# Altium schematic sheet BQ76930.SchDoc
size A3
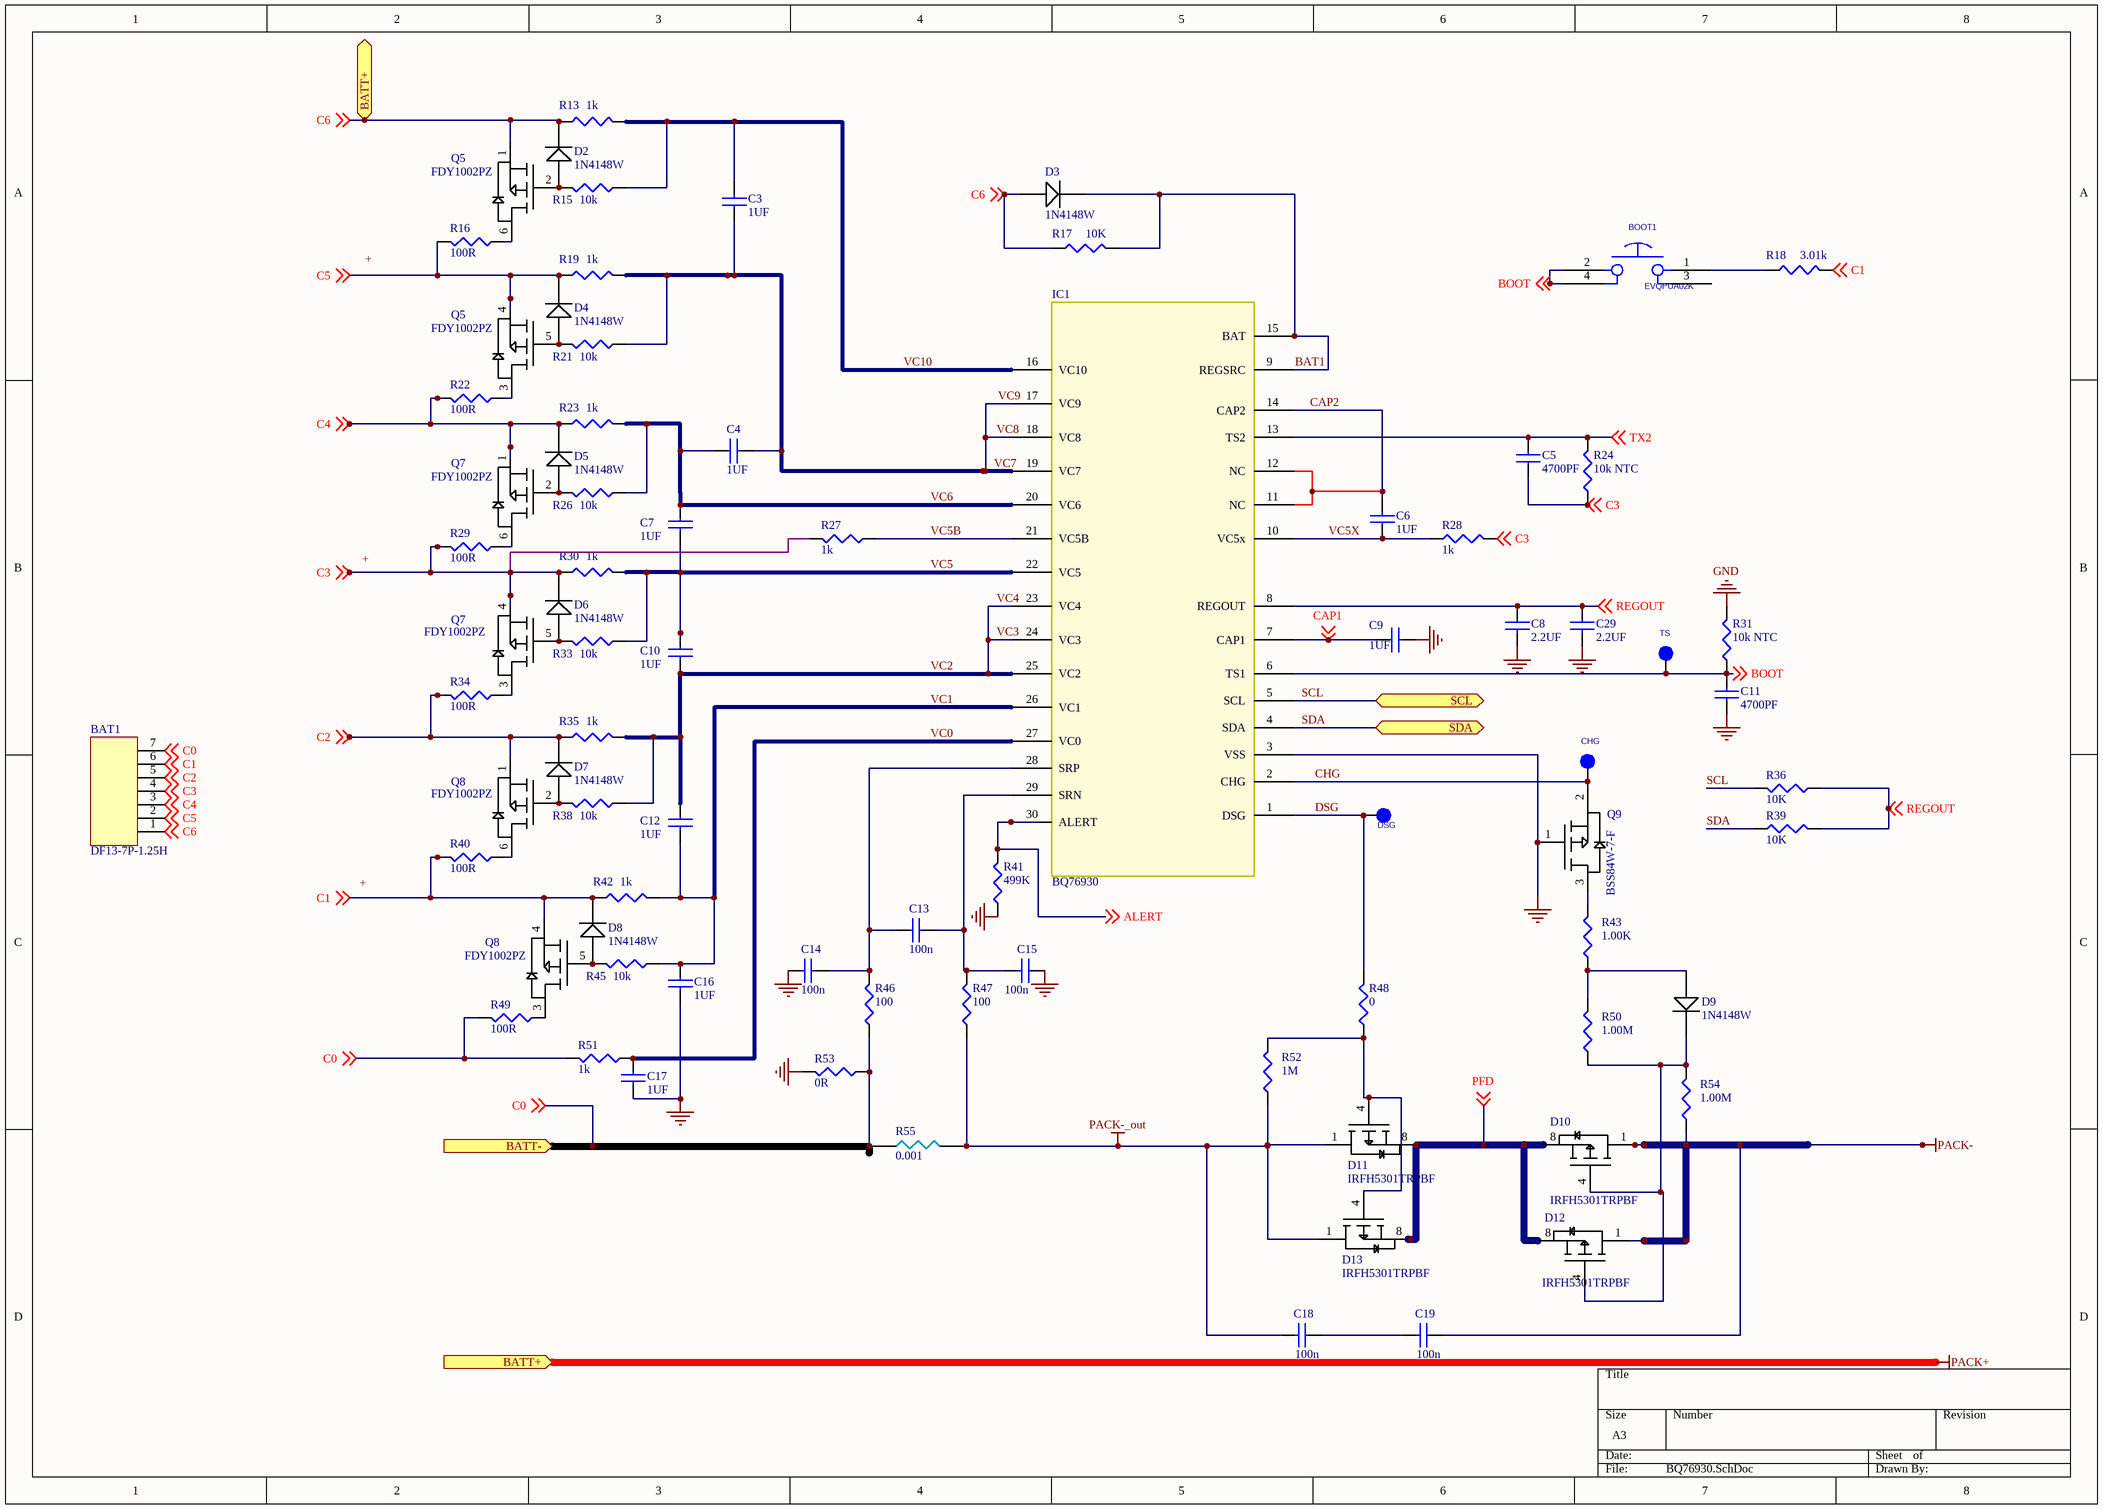
[diagram p0: BQ76930.SchDoc]

## Parts
(Parts that share a designator on the sheet are numbered #1, #2 ... from top to bottom, then left to right.)
BAT1  DF13-7P-1.25H  [DF13-7P-1.25H]
BOOT1  EVQPUA02K  [SKRPAB]
C3  1UF  [0603c]
C4  1UF  [0603c]
C5  4700PF  [0603C]
C6  1UF  [0603c]
C7  1UF  [0603c]
C8  2.2UF  [0603c]
C9  1UF  [0603c]
C10  1UF  [0603c]
C11  4700PF  [0603C]
C12  1UF  [0603c]
C13  100n  [0402CAP]
C14  100n  [0402CAP]
C15  100n  [0402CAP]
C16  1UF  [0603c]
C17  1UF  [0603c]
C18  100n  [0402CAP]
C19  100n  [0402CAP]
C29  2.2UF  [0603c]
CHG  tpad_020  [tpad_020]  (value not drawn)
D2  1N4148W  [SOD323]
D3  1N4148W  [SOD-123]
D4  1N4148W  [SOD323]
D5  1N4148W  [SOD323]
D6  1N4148W  [SOD323]
D7  1N4148W  [SOD323]
D8  1N4148W  [SOD323]
D9  1N4148W  [SOD-123]
D10  IRFH5301TRPBF  [SON5x6]
D11  IRFH5301TRPBF  [SON5x6]
D12  IRFH5301TRPBF  [SON5x6]
D13  IRFH5301TRPBF  [SON5x6]
DSG  tpad_020  [tpad_020]  (value not drawn)
IC1  BQ76930  [TSSOP30]
Q5#1  FDY1002PZ
Q5#2  FDY1002PZ  [DFN2*2-6L]
Q7#1  FDY1002PZ
Q7#2  FDY1002PZ  [DFN2*2-6L]
Q8#1  FDY1002PZ
Q8#2  FDY1002PZ  [DFN2*2-6L]
Q9  BSS84W-7-F  [SOT-323]
R13  1k  [0603r]
R15  10k  [0603r]
R16  100R  [0603r]
R17  10K  [0603R]
R18  3.01k  [0603R]
R19  1k  [0603r]
R21  10k  [0603r]
R22  100R  [0603r]
R23  1k  [0603r]
R24  10k NTC  [0603R]
R26  10k  [0603r]
R27  1k  [0603r]
R28  1k  [0603R]
R29  100R  [0603r]
R30  1k  [0603r]
R31  10k NTC  [0603R]
R33  10k  [0603r]
R34  100R  [0603r]
R35  1k  [0603r]
R36  10K  [0603R]
R38  10k  [0603r]
R39  10K  [0603R]
R40  100R  [0603r]
R41  499K  [0603R]
R42  1k  [0603r]
R43  1.00K  [0603R]
R45  10k  [0603r]
R46  100  [0603R]
R47  100  [0603R]
R48  0  [0603R]
R49  100R  [0603r]
R50  1.00M  [0603R]
R51  1k  [0603r]
R52  1M  [0603R]
R53  0R  [0805L]
R54  1.00M  [0603R]
R55  0.001  [Dale_WSR-3]
TS  tpad_020  [tpad_020]  (value not drawn)

## Ports
BATT+ (in), BATT- (in), SCL, SDA

## Nets
GND: C8.2 C9.2 C11.1 C14.1 C15.1 C16.2 C17.2 C29.2 IC1.3(VSS) Q9.1(G) R31.2 R41.1 R53.2
PACK+: BAT1.1 D2.C(K) D3.A Q5#1.1(S) R13.1 R17.1 ; off-sheet C6, port BATT+  [also labelled C6]
PACK-: C19.1 D10.1(S) D12.1(S) R54.1
PACK-_out: C18.2 D11.1(S) D13.1(S) R47.1 R52.1 R55.2
ALERT: IC1.30(ALERT) R41.2 ; off-sheet ALERT
BAT1: D3.K IC1.9(REGSRC) IC1.15(BAT) R17.2
BOOT: BOOT1.2 BOOT1.4 C11.2 IC1.6(TS1) R31.1 TS.1(Pin1) ; off-sheet BOOT
C0: BAT1.7 R46.1 R49.2 R51.2 R53.1 R55.1 ; off-sheet C0, port BATT-
C1: BAT1.6 D8.C Q8#2.4(S) R18.2 R40.2 R42.1 ; off-sheet C1
C2: BAT1.5 D7.C(K) Q8#1.1(S) R34.2 R35.1 ; off-sheet C2
C3: BAT1.4 C5.1 D6.C(K) Q7#2.4(S) R24.1 R27.2 R28.2 R29.2 R30.1 ; off-sheet C3
C4: BAT1.3 D5.C(K) Q7#1.1(S) R22.2 R23.1 ; off-sheet C4
C5: BAT1.2 D4.C(K) Q5#2.4(S) R16.2 R19.1 ; off-sheet C5
CAP1: C9.1 IC1.7(CAP1) ; off-sheet CAP1
CAP2: C6.2 IC1.11(NC) IC1.12(NC) IC1.14(CAP2)
CHG: CHG.1(Pin1) IC1.2(CHG) Q9.2(S)
DSG: DSG.1(Pin1) IC1.1(DSG) R48.2
PFD: D10.8(D) D11.8(D) D12.8(D) D13.8(D) ; off-sheet PFD
REGOUT: C8.1 C29.1 IC1.8(REGOUT) R36.1 R39.2 ; off-sheet REGOUT
SCL: IC1.5(SCL) R36.2 ; port SCL
SDA: IC1.4(SDA) R39.1 ; port SDA
TX2: C5.2 IC1.13(TS2) R24.2 ; off-sheet TX2
VC0: C17.1 IC1.27(VC0) R51.1
VC1: C12.2 C16.1 IC1.26(VC1) R42.2 R45.1
VC2: C10.2 C12.1 IC1.23(VC4) IC1.24(VC3) IC1.25(VC2) R35.2 R38.1  [also labelled VC3, VC4]
VC5: C7.2 C10.1 IC1.22(VC5) R30.2 R33.1
VC5B: IC1.21(VC5B) R27.1
VC5X: C6.1 IC1.10(VC5x) R28.1
VC6: C4.1 C7.1 IC1.20(VC6) R23.2 R26.1
VC7: C3.1 C4.2 IC1.17(VC9) IC1.18(VC8) IC1.19(VC7) R19.2 R21.1  [also labelled VC8, VC9]
VC10: C3.2 IC1.16(VC10) R13.2 R15.1
NetBOOT1_1: BOOT1.1 R18.1
NetC13_1: C13.1 C14.2 IC1.28(SRP) R46.2
NetC13_2: C13.2 C15.2 IC1.29(SRN) R47.2
NetC18_1: C18.1 C19.2
NetD2_A: D2.A Q5#1.2(G) R15.2
NetD4_A: D4.A Q5#2.5(G) R21.2
NetD5_A: D5.A Q7#1.2(G) R26.2
NetD6_A: D6.A Q7#2.5(G) R33.2
NetD7_A: D7.A Q8#1.2(G) R38.2
NetD8_A: D8.A Q8#2.5(G) R45.2
NetD9_A: D9.A R43.1 R50.2
NetD9_K: D9.K D10.4(G) D12.4(G) R50.1 R54.2
NetD11_4: D11.4(G) D13.4(G) R48.1 R52.2
NetQ5#1_6: Q5#1.6(D) R16.1
NetQ5#2_3: Q5#2.3(D) R22.1
NetQ7#1_6: Q7#1.6(D) R29.1
NetQ7#2_3: Q7#2.3(D) R34.1
NetQ8#1_6: Q8#1.6(D) R40.1
NetQ8#2_3: Q8#2.3(D) R49.1
NetQ9_3: Q9.3(D) R43.2

Not connected (* = marked no-connect by the designer): BOOT1 3

## Notes on the sheet
- Labels drawn without touching a wire or pin: +

## Library data of the parts
BOOT1 = EDGE_MOUNT_PB_SW_2: SW SPST NO PB 2.2N SIDE 12V 50MA SMT; CLASS: IC; CAD_APPROVED: Yes; MFG_NAME01: PANASONIC; AGILE_PN: 510-76838; HEIGHT: 1.95MM; ROHS: Yes; MFG_PN01: EVQPUA02K
C3-C19 C29 = C1005X5R1H104K: CAP CER .10UF 50V X5R 10% 0402; Manufacturer: TDK Corporation; Capacitance: 0.1礔; Value: 100nF; .Checked PCB: used; Tolerance: ?0%; Category: Capacitors; Supplier Part Number: 445-5942-1-ND; Manufacturer Part Number: C1005X5R1H104K; Operating Temperature: -55癈 ~ 85癈; Package / Case: 0402 (1005 Metric); Price 1k [$]: 0.02340; .Checked SCH: used; Voltage - Rated: 50V; Supplier: Digikey; Supplier 1: Digi-Key; Supplier Part Number 1: 445-5942-1-ND; RoHS: RoHS Compliant; Stock 1: 106926; Pricing 1: 1=0.27, 10=0.18, 100=0.072, 250=0.05176, 500=0.0369, 1000=0.027 (USD); Temperature Coefficient: X5R; Mounting Type: Surface Mount, MLCC; Applications: General Purpose; Ratings: -; Size / Dimension: 0.039" L x 0.020" W (1.00mm x 0.50mm); Height - Seated (Max): -; Thickness (Max): 0.022" (0.55mm); Lead Spacing: -; Features: -; Packaging: Cut Tape (CT); Lead Style: -; ComponentLink1URL: http://www.tdk.co.jp/tefe02/e412_c.pdf; ComponentLink1Description: http://www.tdk.co.jp/tefe02/e412_c.pdf
CHG DSG TS = TESTLOOP: TEST POINT PAD 0.5MM DIA SMT, NO PART TO ORDER; CLASS: IO; AGILE_PN: 211-77484; ASSY_OPT: DNP; CAD_APPROVED: Yes; ROHS: Yes; HEIGHT: 0.1MM
D10-D13 = P_MOS_2
Q5#1 Q5#2 Q7#1 Q7#2 Q8#1 Q8#2 = BSS84-7-F
Q9 = BSS84W
R13 R15-R19 R21-R24 R26-R31 R33-R36 R38-R43 R45-R54 = RMCF0402FT4K99: RES TF 4.99K OHM 1% 1/16W 0402; Manufacturer: Stackpole Electronics Inc; Power (Watts): 0.063W, 1/16W; Tolerance: ?%; Value: 4k99; .Checked PCB: used; Temperature Coefficient: ?00ppm/癈; Category: Resistors; Supplier Part Number: RMCF0402FT4K99CT-ND; Manufacturer Part Number: RMCF0402FT4K99; Package / Case: 0402 (1005 Metric); Price 1k [$]: 0.00384; Resistance (Ohms): 4.99K; .Checked SCH: used; Supplier: Digikey; Supplier 1: Digi-Key; Supplier Part Number 1: RMCF0402FT4K99CT-ND; RoHS: RoHS Compliant; Stock 1: 48509; Pricing 1: 1=0.04, 10=0.025, 50=0.0138, 100=0.0105, 250=0.0078, 500=0.00576, 1000=0.00384 (USD); Composition: Thick Film; Features: -; Size / Dimension: 0.039" L x 0.020" W (1.00mm x 0.50mm); Height: 0.016" (0.40mm); Number of Terminations: 2; Packaging: Cut Tape (CT); ComponentLink1URL: http://www.seielect.com/Catalog/SEI-RMCF.pdf; ComponentLink1Description: http://www.seielect.com/Catalog/SEI-RMCF.pdf
R55 = DALE_WSR3